# EAGLE design Nano 3 KeyPad interface V2 (EAGLE 5.10)
FUNCTION: Red/Green LED
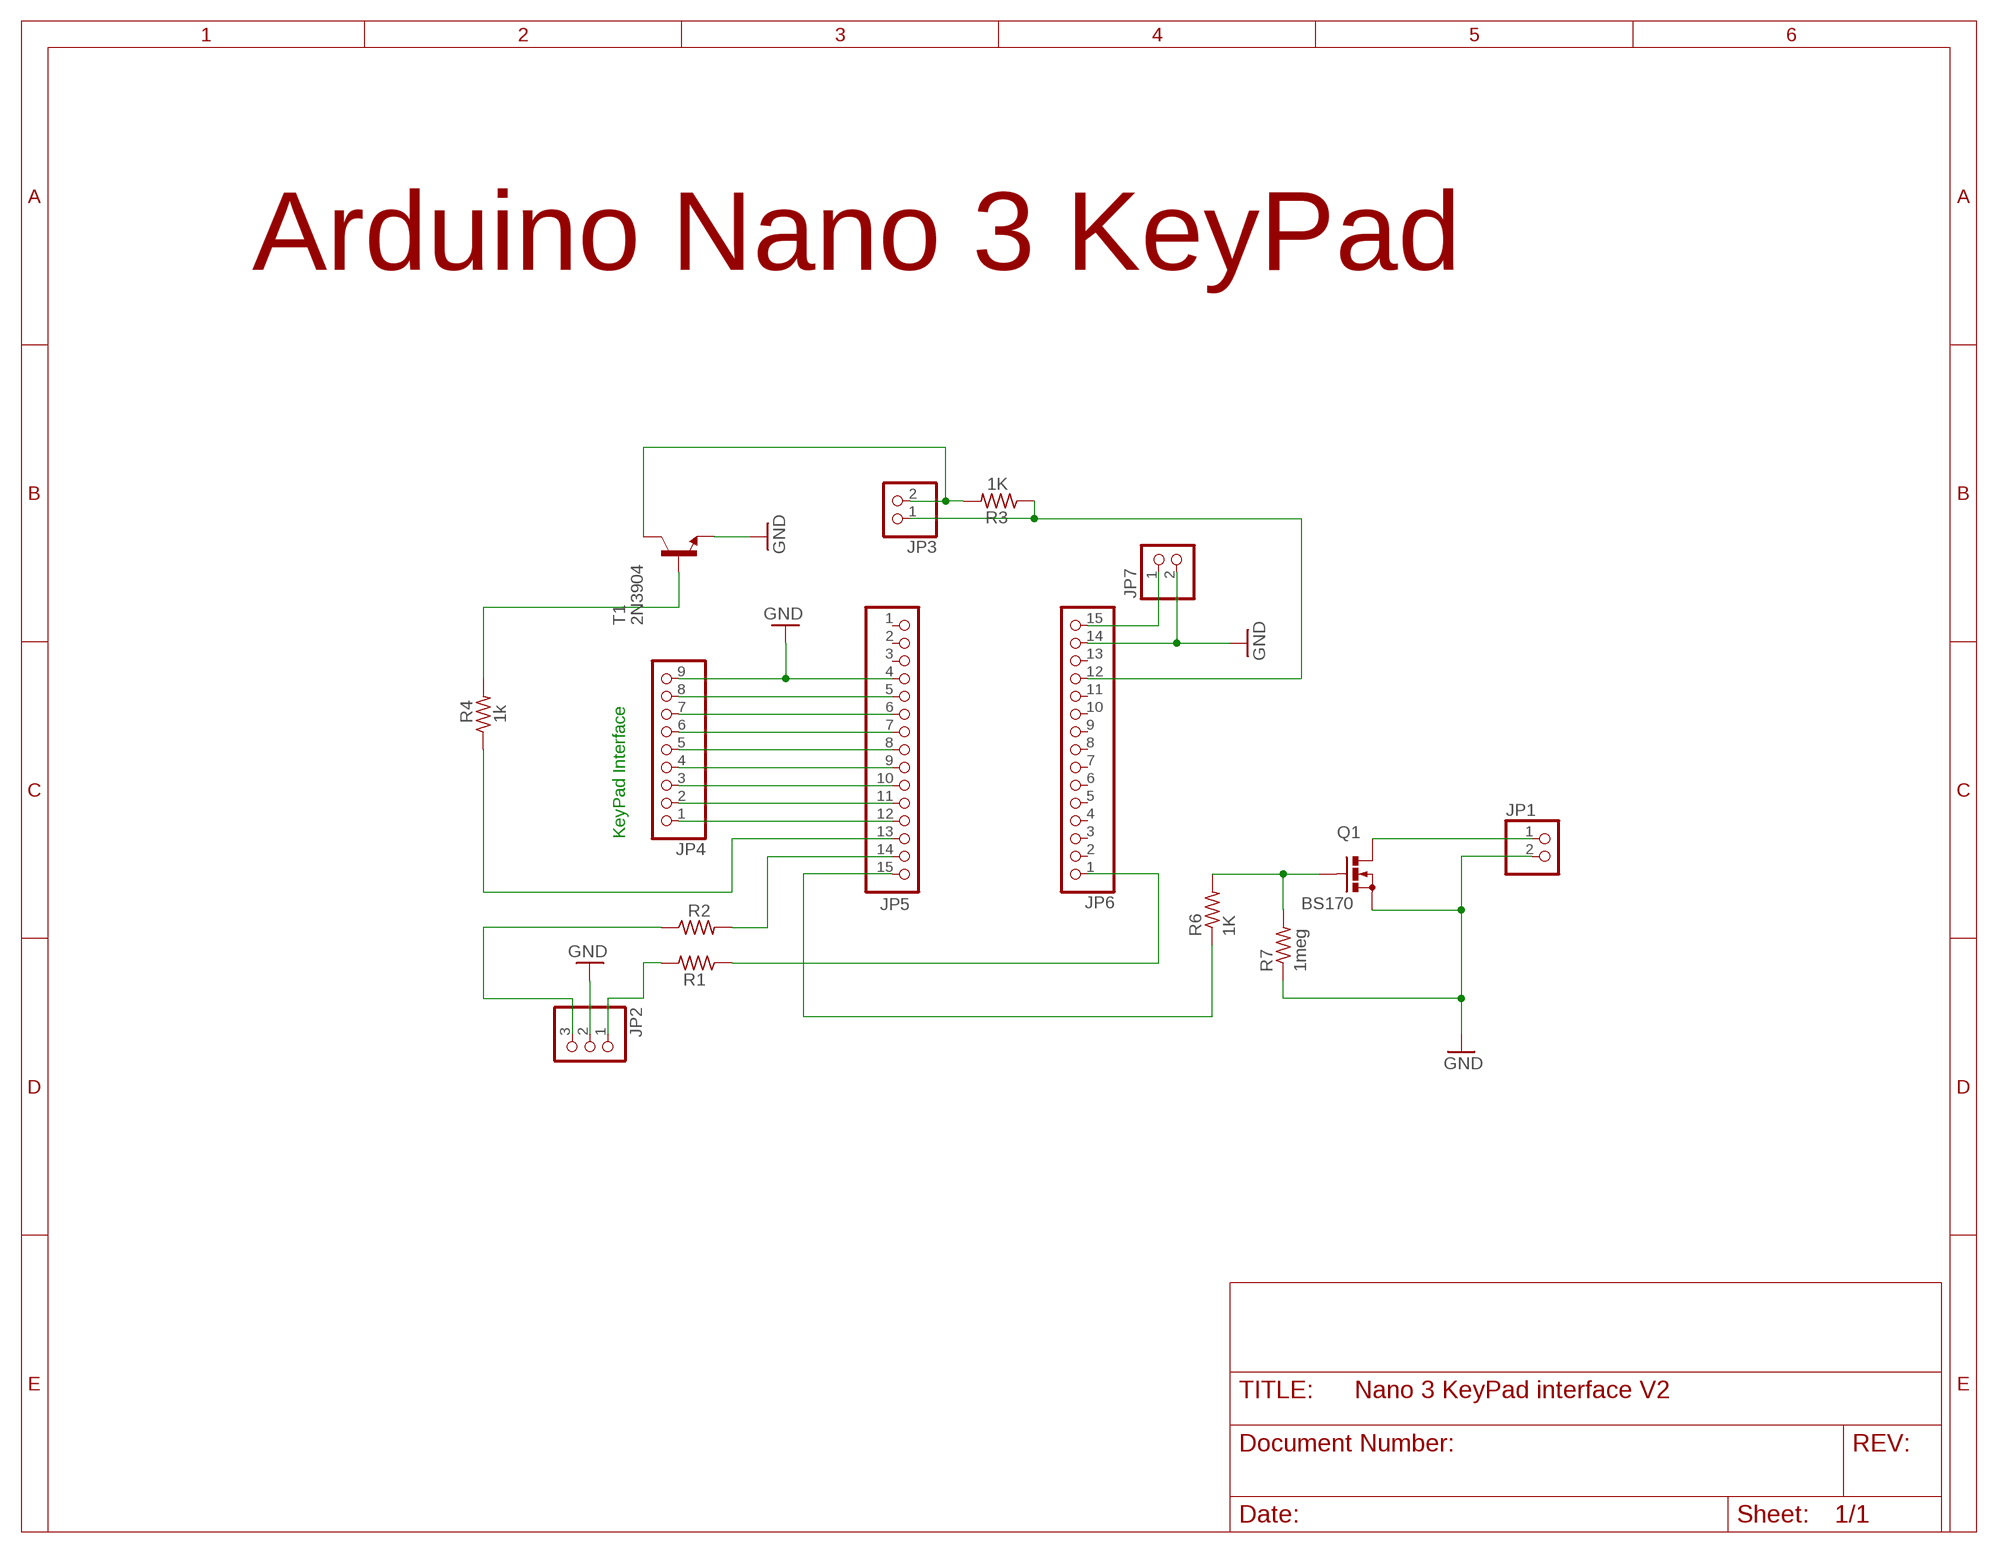
[diagram p0: schematic, sheet 1]

## Parts
JP1  PINHD-1X2  [1X02]
JP2  PINHD-1X3  [1X03]
JP3  PINHD-1X2  [1X02]
JP4  PINHD-1X9  [1X09]
JP5  PINHD-1X15  [1X15]
JP6  PINHD-1X15  [1X15]
JP7  PINHD-1X2  [1X02]
Q1  BS170  [SOT54E]
R1  R-US_0207/10  [0207/10]
R2  R-US_0207/10  [0207/10]
R3  1K  R-US_0207/10  [0207/10]
R4  1k  R-US_0207/10  [0207/10]
R6  1K  R-US_0207/10  [0207/10]
R7  1meg  R-US_0207/10  [0207/10]
T1  2N3904  [TO92]

## Nets
GND: JP1.2 JP2.2 JP4.9 JP5.4 JP6.14 JP7.2 Q1.S R7.1 T1.3(E)
N$1: JP1.1 Q1.D
N$2: R4.2 T1.2(B)
N$3: JP5.13 R4.1
N$4: JP6.1 R1.1
N$5: JP5.14 R2.2
N$6: JP5.15 R6.1
N$8: Q1.G R6.2 R7.2
N$9: JP3.1 JP6.12 R3.1
N$10: JP3.2 R3.2 T1.1(C)
N$11: JP2.3 R2.1
N$13: JP4.1 JP5.12
N$14: JP4.2 JP5.11
N$15: JP4.3 JP5.10
N$16: JP4.4 JP5.9
N$17: JP4.5 JP5.8
N$18: JP4.6 JP5.7
N$19: JP4.7 JP5.6
N$20: JP4.8 JP5.5
N$21: JP2.1 R1.2
N$22: JP6.15 JP7.1
Unconnected: JP5.1 JP5.2 JP5.3 JP6.2 JP6.3 JP6.4 JP6.5 JP6.6 JP6.7 JP6.8 JP6.9 JP6.10 JP6.11 JP6.13

## Notes on the sheet
- Arduino Nano 3 KeyPad
- KeyPad Interface

## Library data of the parts
JP1 JP3 JP7 = pinhead:PINHD-1X2: PIN HEADER
JP2 = pinhead:PINHD-1X3: PIN HEADER
JP4 = pinhead:PINHD-1X9: PIN HEADER
JP5 JP6 = pinhead:PINHD-1X15: PIN HEADER
Q1 = transistor-small-signal:BS170: N-CHANNEL MOS FET
R1-R4 R6 R7 = rcl:R-US_: RESISTOR, American symbol
T1 = transistor-neu-to92:2N3904: NPN TRANSISTOR

## Board
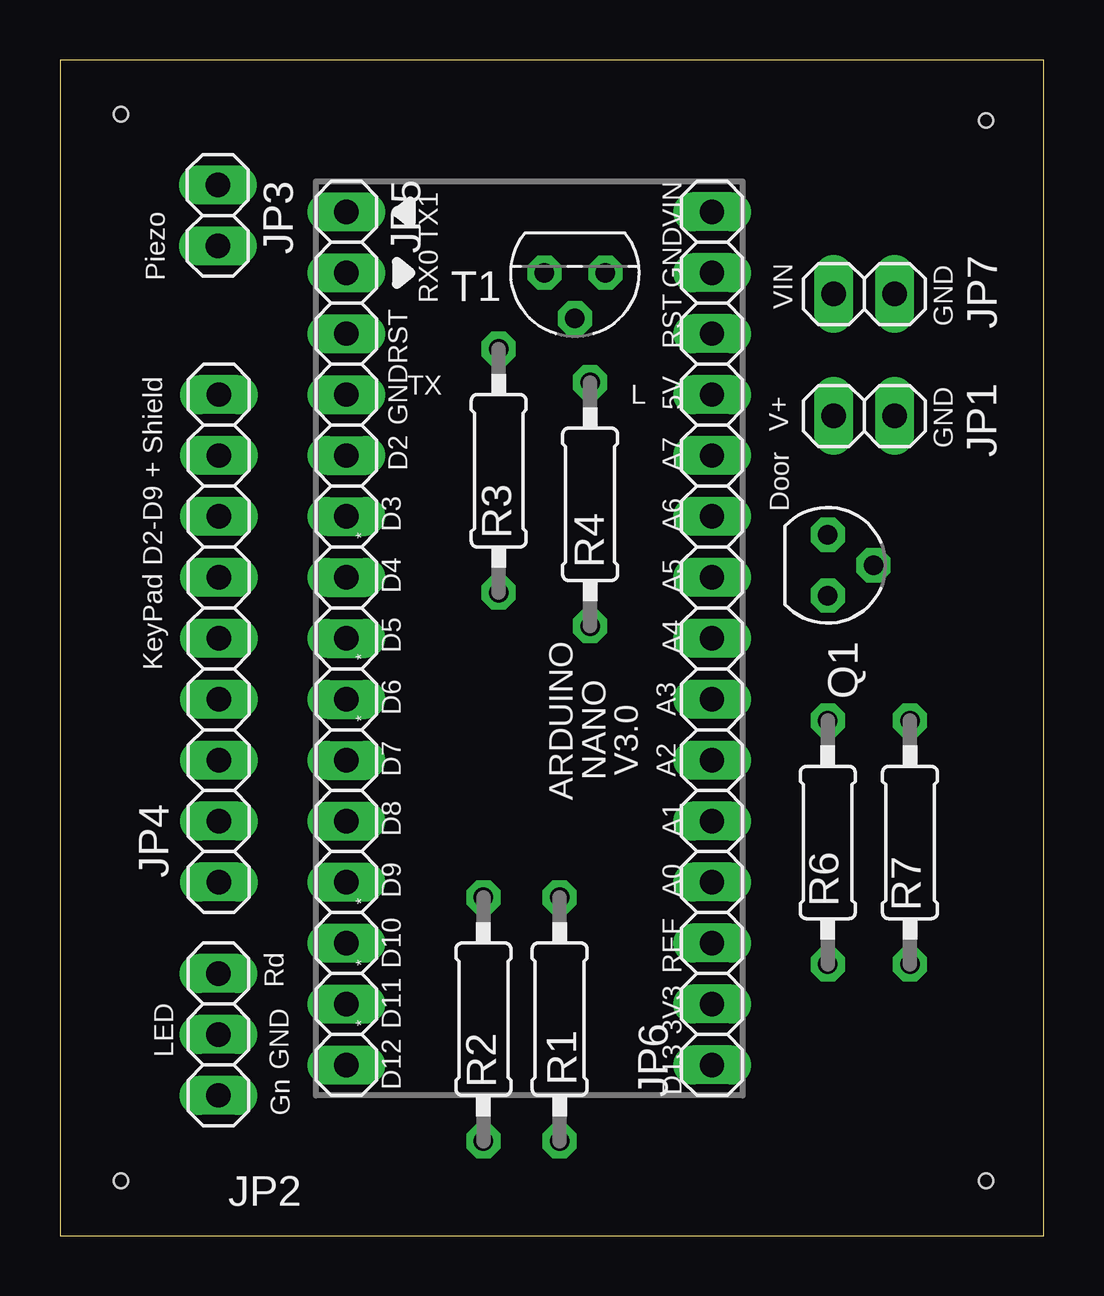
[diagram p1: board, top side]
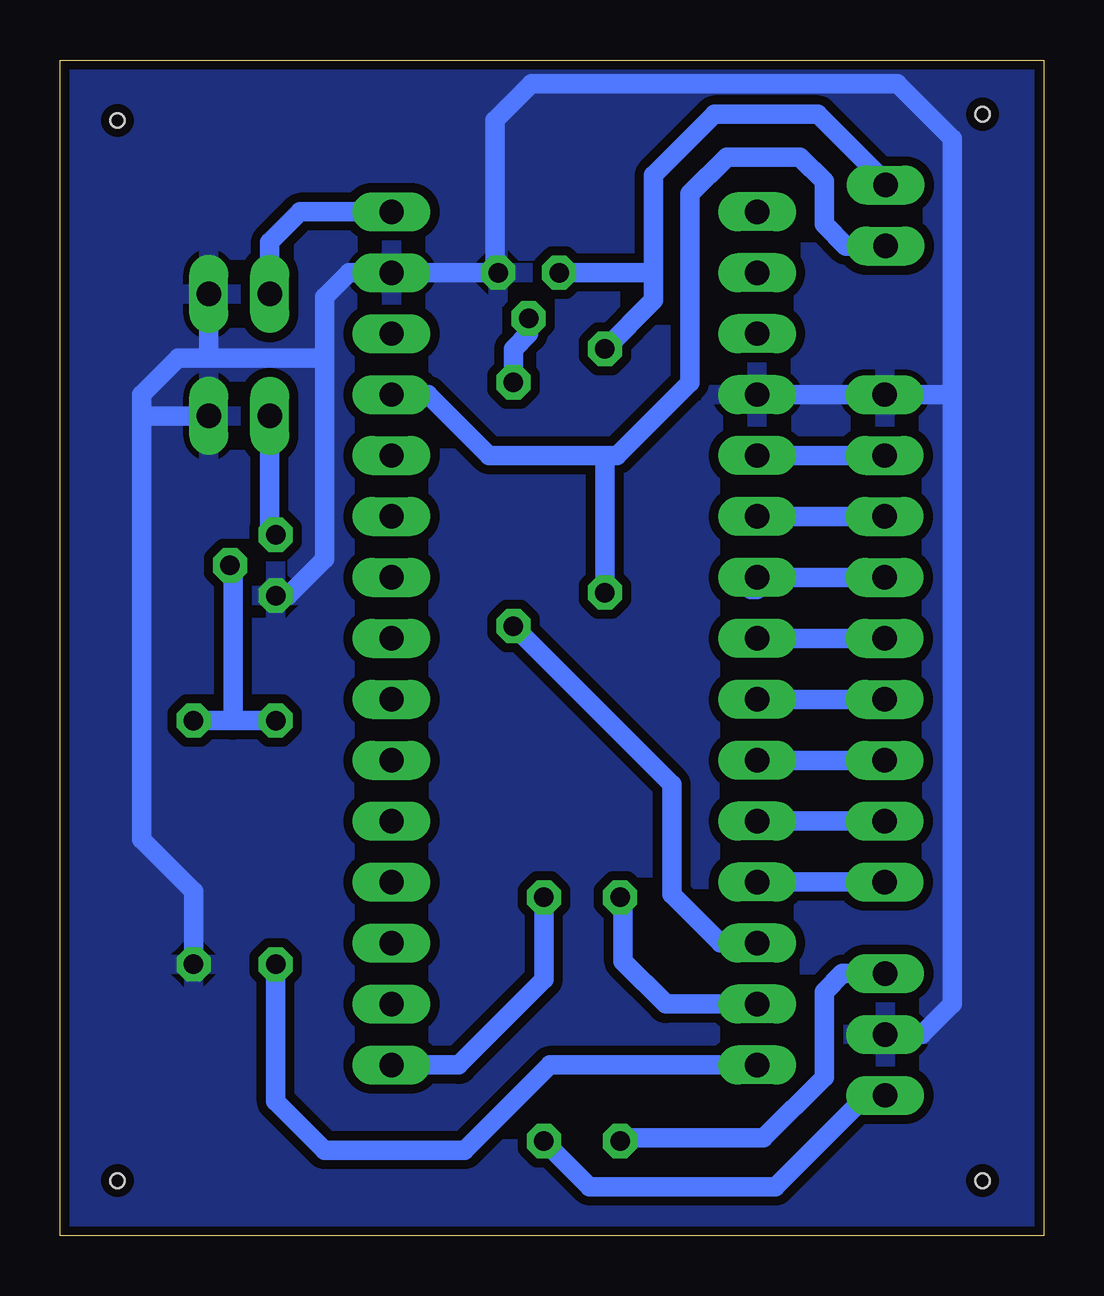
[diagram p2: board, bottom side, seen from below]

Size 41 x 49 mm. Coordinates in mm from the lower left corner, seen from the top.
Outline: 0,0 41,0 41,49 0,49 0,0
Copper layers (1*16): Top 0.035mm / dielectric 1.5mm / Bottom 0.035mm
Design rules "default *": minimum track width 8mil, minimum drill 16mil, track to track 8mil, track to pad 8mil, pad to pad 8mil, via to via 8mil, smd to smd 8mil, copper to edge 8mil, drill to drill 8mil, minimum pad ring 12mil, minimum via ring 8mil, stop-mask expansion 4mil, vias tented up to drill 18mil, thermal gap 10mil
Holes 0.6 mm at 2.54,46.74 38.61,46.48 38.61,2.29 2.54,2.29

### Footprints (pad centres in the part's own frame; a part is rotated, then mirrored left to right if it is on the bottom)
1X02 = drill 1.016 long: 1 -1.27,0; 2 1.27,0
1X03 = drill 1.016 long: 1 -2.54,0; 2 0,0; 3 2.54,0
1X09 = drill 1.016 long: 1 -10.16,0; 2 -7.62,0; 3 -5.08,0; 4 -2.54,0; 5 0,0; 6 2.54,0; 7 5.08,0; 8 7.62,0; 9 10.16,0
1X15 = drill 1.016 long: 1 -17.78,0; 2 -15.24,0; 3 -12.7,0; 4 -10.16,0; 5 -7.62,0; 6 -5.08,0; 7 -2.54,0; 8 0,0; 9 2.54,0; 10 5.08,0; 11 7.62,0; 12 10.16,0; 13 12.7,0; 14 15.24,0; 15 17.78,0
SOT54E = drill 0.813 octagon: D -1.27,0; G 0,1.905; S 1.27,0
0207/10 = drill 0.813 octagon: 1 -5.08,0; 2 5.08,0
TO92 = drill 0.813 octagon: 1 1.27,0; 2 0,1.905; 3 -1.27,0

### Placement (x,y rotation side)
JP1  33.53,34.16 0 top
JP2  6.6,8.38 90 top
JP3  6.58,42.52 90 top
JP4  6.62,24.89 90 top
JP5  11.94,24.89 270 top
JP6  27.18,24.89 90 top
JP7  33.53,39.24 0 top
Q1  32,27.94 270 top
R1  20.83,9.02 270 top
R2  17.65,9.02 90 top
R3  18.29,31.88 90 top
R4  22.1,30.48 90 top
R6  32,16.38 90 top
R7  35.43,16.38 90 top
T1  21.46,40.13 180 top

### Tracks (layer width: path | path; a pad name or v marks a point on that pad's centre or on a via)
GND
  Bottom 0.813: JP5.4 JP4.9 4.06,35.05 3.81,35.31 | JP2.2 5.08,8.38 3.81,9.65 3.81,35.31 | 37.59,34.29 37.59,35.05 36.07,36.58 34.54,36.58 | JP7.2 34.8,36.83 34.54,36.58 | JP1.2 37.47,34.16 37.59,34.29 | 37.59,34.29 37.59,16.51 35.43,14.35 R7.1 | Q1.S 31.5,26.67 29.97,28.19 29.97,36.58 | 29.97,36.58 29.97,39.12 28.96,40.13 JP6.14 T1.3 22.86,40.26 22.86,46.48 21.34,48.01 6.1,48.01 3.81,45.72 3.81,35.31 | 29.97,36.58 34.54,36.58
  pour Bottom (isolate 0.381): 0,49.02 41.15,49.02 41.15,-0.25 0,-0.25
N$1
  Bottom 0.813: JP1.1 32.26,29.46 Q1.D
N$2
  Bottom 0.813: T1.2 21.46,37.59 22.1,36.96 R4.2
N$3
  Bottom 0.813: JP5.13 13.46,12.19 15.49,14.22 15.49,18.8 R4.1
N$4
  Bottom 0.813: R1.1 20.83,10.67 24.38,7.11 JP6.1
N$5
  Bottom 0.813: JP5.14 15.75,9.65 17.53,11.43 17.53,13.97 R2.2
N$6
  Bottom 0.813: JP5.15 20.57,7.11 24.13,3.56 29.97,3.56 32,5.59 R6.1
N$8
  Bottom 0.813: R6.2 33.78,21.46 | 33.78,21.46 R7.2 | 33.78,21.46 33.78,27.81 Q1.G
N$9
  Bottom 0.813: 18.29,32.51 17.78,32.51 14.73,35.56 14.73,43.43 13.21,44.96 10.16,44.96 9.14,43.94 9.14,42.16 8.23,41.25 JP3.1 | 18.29,32.51 23.11,32.51 25.65,35.05 JP6.12 | R3.1 18.29,32.51
N$10
  Bottom 0.813: 16.26,40.13 16.26,44.2 13.72,46.74 9.4,46.74 6.58,43.91 JP3.2 | 16.26,40.13 16.26,38.99 R3.2 | 16.26,40.13 T1.1
N$11
  Bottom 0.813: JP2.3 8.38,10.92 9.14,10.16 9.14,6.6 11.68,4.06 17.53,4.06 R2.1
N$13
  Bottom 0.813: JP4.1 JP5.12
N$14
  Bottom 0.813: JP4.2 JP5.11
N$15
  Bottom 0.813: JP4.3 JP5.10
N$16
  Bottom 0.813: JP4.4 JP5.9
N$17
  Bottom 0.813: JP4.5 JP5.8
N$18
  Bottom 0.813: JP4.6 JP5.7 | JP5.7 12.19,27.43 12.19,26.92 11.94,26.92 JP5.7
N$19
  Bottom 0.813: JP4.7 JP5.6
N$20
  Bottom 0.813: JP4.8 JP5.5
N$21
  Bottom 0.813: JP2.1 7.37,5.84 11.18,2.03 18.92,2.03 R1.2
N$22
  Bottom 0.813: JP6.15 30.99,42.67 32.26,41.4 JP7.1

### Text on the board
tPlace: Piezo | VIN | TX1 | VIN | GND | RX0 | GND | RST | KeyPad D2-D9 + Shield | RST | TX | L | GND | GND | 5V | V+ | D2 | A7 | Door | * | D3 | A6 | D4 | A5 | * | D5 | A4 | D6 | A3 | * | D7 | NANO | V3.0 | A2 | ARDUINO | D8 | A1 | * | D9 | A0 | * | D10 | REF | LED | Rd | GND | * | D11 | 3V3 | D12 | D13 | Gn